# EAGLE schematic spacer_board (EAGLE 7.5.0)
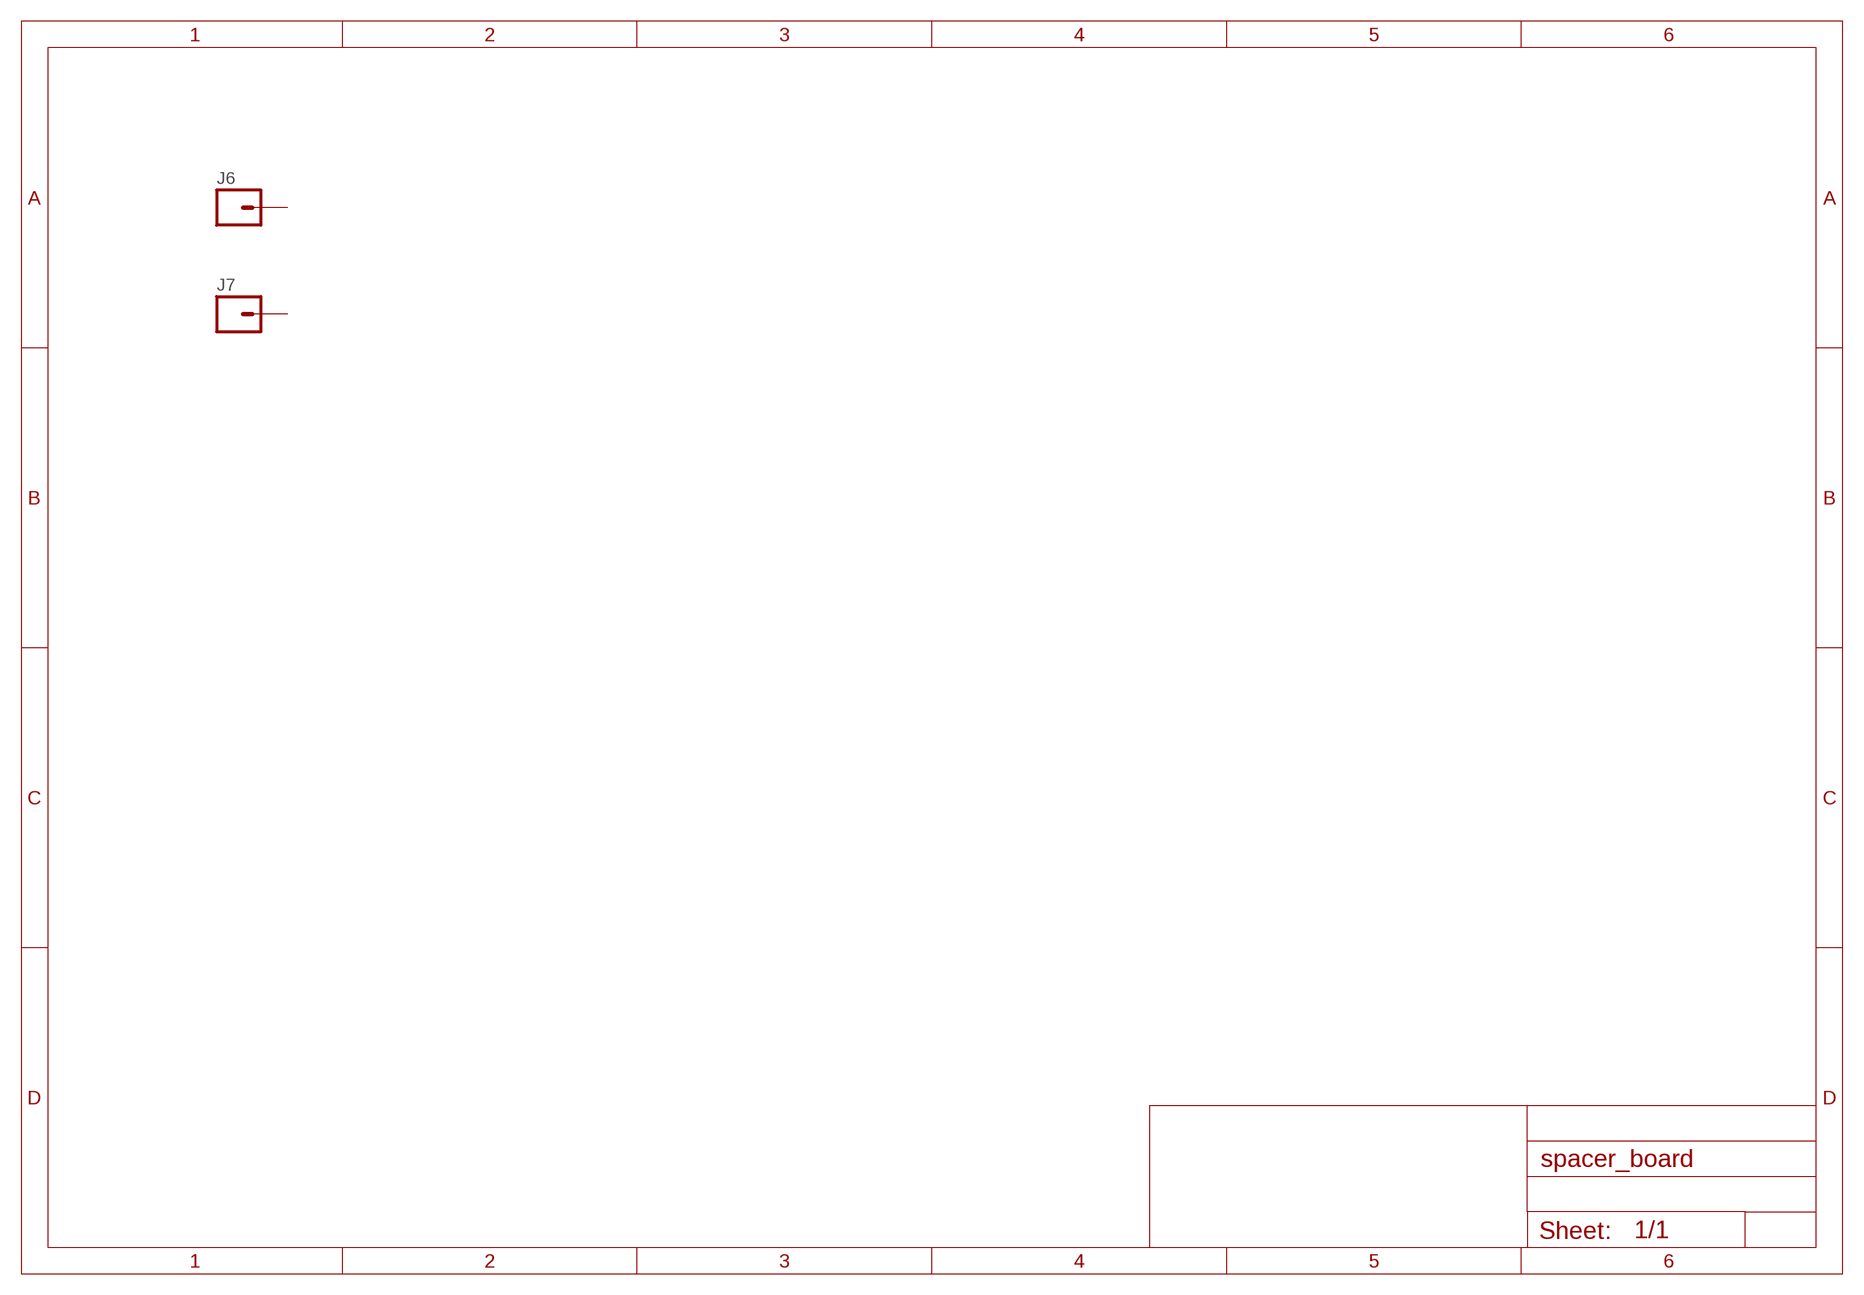
[diagram p0: schematic, sheet 1]

## Parts
J6  M01  [1X01_BIG]
J7  M01  [1X01_BIG]
Unconnected: J6.1 J7.1

## Library data of the parts
J6 J7 = SparkFun-Connectors 2:M01: Header 1 Standard 1-pin 0.1" header. Use with straight break away headers (SKU : PRT-00116), right angle break away headers (PRT-00553), swiss pins (PRT-00743), machine pins (PRT-00117), and female headers (PRT-00115). SMTSO-256-ET is a "flush mount" nut for a 4-40 screw. The older package used to be too tight, and did not allow it to sit properly thru the drill hit. The latest (0.165DIA) fits nice and snug.